# EAGLE design Programmateur-ICSP-Atmel (EAGLE 8.3.2)
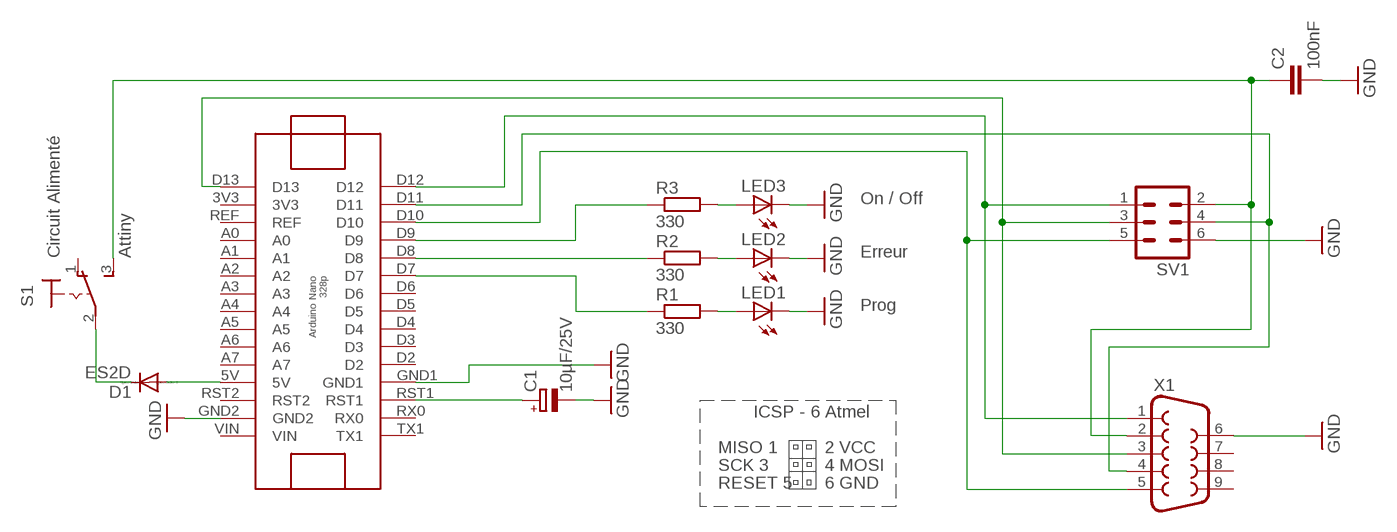
[diagram p0: schematic, sheet 1]

## Parts
ARDUINO-NANO1  ARDUINO-NANO  [ARDUINO-NANO]
C1  10µF/25V  CPOL-EUE2.5-5  [E2,5-5]
C2  100nF  C-EUC0805  [C0805]
D1  ES2D  [SMB]
LED1  LED5MM  [LED5MM]
LED2  LED5MM  [LED5MM]
LED3  LED5MM  [LED5MM]
R1  330  R-EU_R0805  [R0805]
R2  330  R-EU_R0805  [R0805]
R3  330  R-EU_R0805  [R0805]
S1  320-916  [320-916]
SV1  ML6L  [ML6L]
X1  F09HP  [F09HP]

## Nets
GND: ARDUINO-NANO1.GND1 ARDUINO-NANO1.GND2 C1.- C2.2 LED1.K(C) LED2.K(C) LED3.K(C) SV1.6 X1.6
MISO: ARDUINO-NANO1.D12 SV1.1 X1.1
MOSI: ARDUINO-NANO1.D11 SV1.4 X1.4
N$1: LED1.A R1.2
N$2: ARDUINO-NANO1.D7 R1.1
N$3: ARDUINO-NANO1.D8 R2.1
N$4: LED2.A R2.2
N$5: ARDUINO-NANO1.D9 R3.1
N$6: LED3.A R3.2
N$7: ARDUINO-NANO1.5V D1.A
N$9: ARDUINO-NANO1.RST1 C1.+
N$11: D1.C S1.2(P)
RESET: ARDUINO-NANO1.D10 SV1.5 X1.5
SCK: ARDUINO-NANO1.D13 SV1.3 X1.3
VCC: C2.1 S1.3(S) SV1.2 X1.2
Unconnected: ARDUINO-NANO1.3V3 ARDUINO-NANO1.A0 ARDUINO-NANO1.A1 ARDUINO-NANO1.A2 ARDUINO-NANO1.A3 ARDUINO-NANO1.A4 ARDUINO-NANO1.A5 ARDUINO-NANO1.A6 ARDUINO-NANO1.A7 ARDUINO-NANO1.D2 ARDUINO-NANO1.D3 ARDUINO-NANO1.D4 ARDUINO-NANO1.D5 ARDUINO-NANO1.D6 ARDUINO-NANO1.REF ARDUINO-NANO1.RST2 ARDUINO-NANO1.RX0 ARDUINO-NANO1.TX1 ARDUINO-NANO1.VIN S1.1(O) X1.7 X1.8 X1.9

## Notes on the sheet
- On / Off
- Circuit Alimenté | Attiny | Erreur
- Prog
- ICSP - 6 Atmel
- MISO 1 | 2 VCC
- SCK 3 | 4 MOSI
- RESET 5 | 6 GND

## Library data of the parts
ARDUINO-NANO1 = Arduino-nano:ARDUINO-NANO
C1 = rcl:CPOL-EU: POLARIZED CAPACITOR, European symbol
C2 = rcl:C-EU: CAPACITOR, European symbol
D1 = diode:ES2D: DIODE super fast rectifier, 2 A
LED1-LED3 = led:LED: LED OSRAM: - CHIPLED LG R971, LG N971, LY N971, LG Q971, LY Q971, LO R971, LY R971 LH N974, LH R974 LS Q976, LO Q976, LY Q976 LO Q996 - Hyper CHIPLED LW Q18S LB Q993, LB Q99A, LB R99A - SideLED LS A670, LO A670, LY A670, LG A670, LP A670 LB A673, LV A673, LT A673, LW A673 LH A674 LY A675 LS A676, LA A676, LO A676, LY A676, LW A676 LS A679, LY A679, LG A679 - Hyper Micro SIDELED® LS Y876, LA Y876, LO Y876, LY Y876 LT Y87S - SmartLED LW L88C, LW L88S LB L89C, LB L89S, LG L890 LS L89K, LO L89K, LY L89K LS L896, LA L896, LO L896, LY L896 - TOPLED LS T670, LO T670, LY T670, LG T670, LP T670 LSG T670, LSP T670, LSY T670, LOP T670, LYG T670 LG T671, LOG T671, LSG T671 LB T673, LV T673, LT T673, LW T673 LH T674 LS T676, LA T676, LO T676, LY T676, LB T676, LH T676, LSB T676, LW T676 LB T67C, LV T67C, LT T67C, LS T67K, LO T67K, LY T67K, LW E67C LS E67B, LA E67B, LO E67B, LY E67B, LB E67C, LV E67C, LT E67C LW T67C LS T679, LY T679, LG T679 LS T770, LO T770, LY T770, LG T770, LP T770 LB T773, LV T773, LT T773, LW T773 LH T774 LS E675, LA E675, LY E675, LS T675 LS T776, LA T776, LO T776, LY T776, LB T776 LHGB T686 LT T68C, LB T68C - Hyper Mini TOPLED® LB M676 - Mini TOPLED Santana® LG M470 LS M47K, LO M47K, LY M47K Source: http://www.osram.convergy.de LUXEON: - LUMILED® LXK2-PW12-R00, LXK2-PW12-S00, LXK2-PW14-U00, LXK2-PW14-V00 LXK2-PM12-R00, LXK2-PM12-S00, LXK2-PM14-U00 LXK2-PE12-Q00, LXK2-PE12-R00, LXK2-PE12-S00, LXK2-PE14-T00, LXK2-PE14-U00 LXK2-PB12-K00, LXK2-PB12-L00, LXK2-PB12-M00, LXK2-PB14-N00, LXK2-PB14-P00, LXK2-PB14-Q00 LXK2-PR12-L00, LXK2-PR12-M00, LXK2-PR14-Q00, LXK2-PR14-R00 LXK2-PD12-Q00, LXK2-PD12-R00, LXK2-PD12-S00 LXK2-PH12-R00, LXK2-PH12-S00 LXK2-PL12-P00, LXK2-PL12-Q00, LXK2-PL12-R00 Source: www.luxeon.com KINGBRIGHT: KA-3528ASYC Source: www.kingbright.com
R1-R3 = rcl:R-EU_: RESISTOR, European symbol
S1 = switch:320-916: TOGGLE SWITCH distributor RS Components
SV1 = con-harting-ml:ML6: HARTING; OC_FARNELL: unknown; OC_NEWARK: unknown
X1 = con-subd:F09: SUB-D; OC_FARNELL: unknown; OC_NEWARK: unknown

## Board
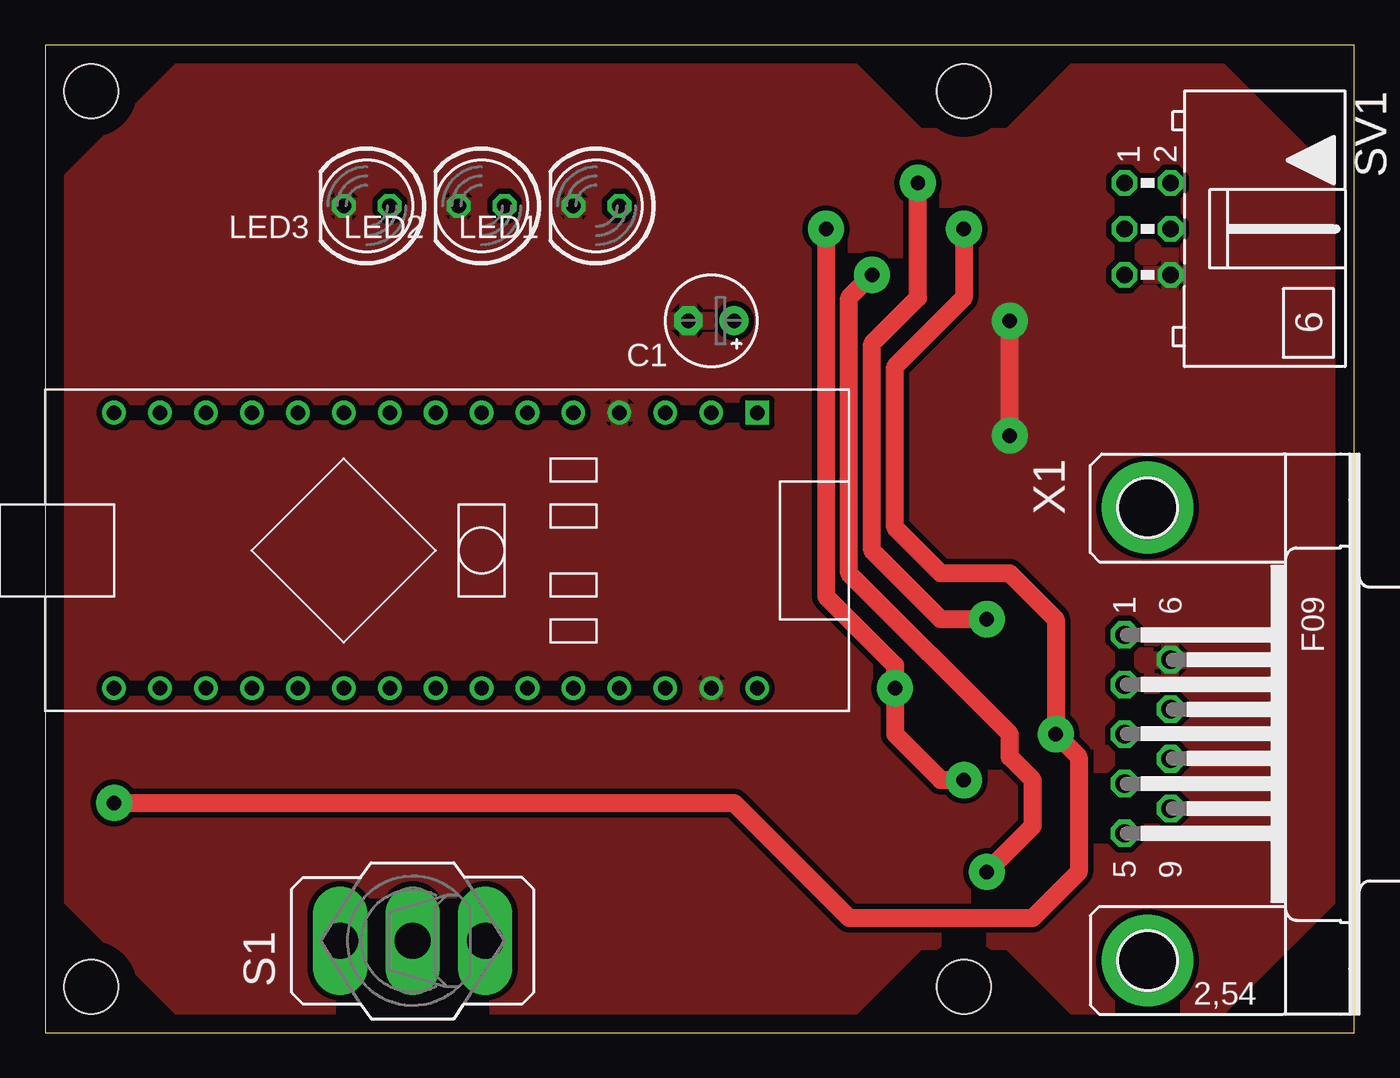
[diagram p1: board, top side]
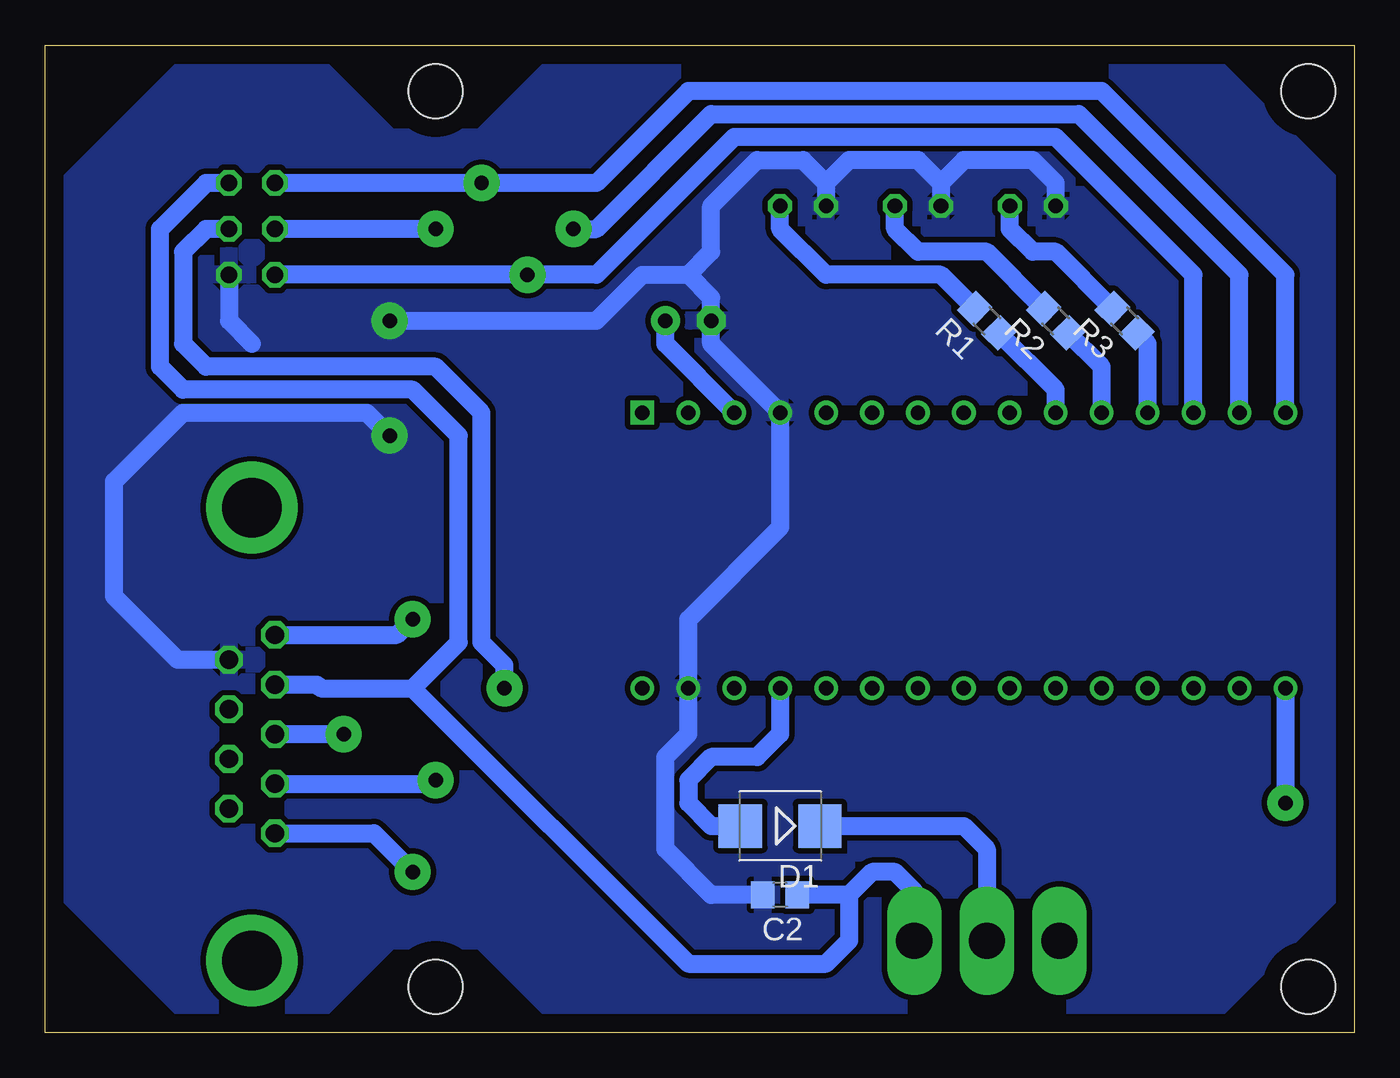
[diagram p2: board, bottom side, seen from below]

Size 72.39 x 54.61 mm. Coordinates in mm from the lower left corner, seen from the top.
Outline: 0,0 72.39,0 72.39,54.61 0,54.6 0,0
Copper layers (1*16): Top 0.035mm / dielectric 1.5mm / Bottom 0.035mm
Design rules "default": minimum track width 6mil, minimum drill 0.35mm, track to track 6mil, track to pad 6mil, pad to pad 6mil, via to via 6mil, smd to smd 6mil, copper to edge 40mil, drill to drill 6mil, minimum pad ring 10mil, minimum via ring 8mil, stop-mask expansion 4mil, vias tented up to drill 0mil, thermal gap 10mil
Holes 3 mm at 2.54,52.07 2.54,2.54 50.8,2.54 50.8,52.07

### Footprints (pad centres in the part's own frame; a part is rotated, then mirrored left to right if it is on the bottom)
ARDUINO-NANO = drill 0.8: 3V3 7.62,-16.51; 5V 7.62,8.89; A0 7.62,-11.43; A1 7.62,-8.89; A2 7.62,-6.35; A3 7.62,-3.81; A4 7.62,-1.27; A5 7.62,1.27; A6 7.62,3.81; A7 7.62,6.35; D2 -7.62,6.35; D3 -7.62,3.81; D4 -7.62,1.27; D5 -7.62,-1.27; D6 -7.62,-3.81; D7 -7.62,-6.35; D8 -7.62,-8.89; D9 -7.62,-11.43; D10 -7.62,-13.97; D11 -7.62,-16.51; D12 -7.62,-19.05; D13 7.62,-19.05; GND1 -7.62,8.89; GND2 7.62,13.97; REF 7.62,-13.97; RST1 -7.62,11.43; RST2 7.62,11.43; RX0 -7.62,13.97; VIN 7.62,16.51 | drill 0.8 square: TX1 -7.62,16.51
E2,5-5 = drill 0.813 pad 1.6: + -1.27,0 | drill 0.813 pad 1.6 octagon: - 1.27,0
C0805 = smd 1.3 x 1.5: 1 -0.95,0; 2 0.95,0
SMB = smd 2.4 x 2.4: A 2.2,0; C -2.2,0
LED5MM = drill 0.813 octagon: A -1.27,0; K 1.27,0
R0805 = smd 1.3 x 1.5: 1 -0.95,0; 2 0.95,0
320-916 = drill 2.007 long: 1 0,4.013; 2 0,0; 3 0,-4.013
ML6L = drill 0.914 octagon: 1 -2.54,-1.27; 2 -2.54,1.27; 3 0,-1.27; 4 0,1.27; 5 2.54,-1.27; 6 2.54,1.27
F09HP = drill 1.016 octagon: 1 -5.486,-1.27; 2 -2.743,-1.27; 3 0,-1.27; 4 2.743,-1.27; 5 5.486,-1.27; 6 -4.115,1.27; 7 -1.372,1.27; 8 1.372,1.27; 9 4.115,1.27 | drill 3.302 pad 5.08: G1 -12.522,0; G2 12.522,0

### Placement (x,y rotation side)
ARDUINO-NANO1  22.86,26.67 270 top
C1  36.83,39.37 180 top
C2  31.75,7.62 180 bottom
D1  31.75,11.43 180 bottom
LED1  30.48,45.72 180 top
LED2  24.13,45.72 180 top
LED3  17.78,45.72 180 top
R1  20.32,39.37 135 bottom
R2  16.51,39.37 135 bottom
R3  12.7,39.37 135 bottom
S1  20.32,5.08 90 top
SV1  60.96,44.45 270 top
X1  60.96,16.51 270 top

### Tracks (layer width: path | path; a pad name or v marks a point on that pad's centre or on a via)
GND  (via drill 0.8 pad 2)
  Top 1: v53.34,33.02 v53.34,39.37
  Bottom 1: LED3.K 16.51,46.99 17.78,48.26 21.59,48.26 22.86,46.99 | 22.86,46.99 LED2.K | 22.86,46.99 24.13,48.26 27.94,48.26 29.21,46.99 | 29.21,46.99 LED1.K | 29.21,46.99 30.48,48.26 33.02,48.26 35.56,45.72 35.56,43.18 36.83,41.91 | C2.2 35.56,7.62 38.1,10.16 38.1,15.24 36.83,16.51 ARDUINO-NANO1.GND2 36.83,22.86 31.75,27.94 ARDUINO-NANO1.GND1 35.56,38.1 C1.- 35.56,40.64 36.83,41.91 | X1.6 65.08,20.62 68.58,24.13 68.58,30.48 64.77,34.29 54.61,34.29 v53.34,33.02 | v53.34,39.37 41.91,39.37 39.37,41.91 36.83,41.91 | SV1.6 62.23,39.37 60.96,38.1
  pour Bottom (isolate 0.3): 8.89,54.61 0,45.72 0,8.89 8.89,0 43.18,0 48.26,5.08 53.34,5.08 58.42,0 63.5,0 72.39,8.89 72.39,45.72 63.5,54.61 58.42,54.61 53.34,49.53 48.26,49.53 43.18,54.61
  pour Top (isolate 0.3): 0,45.72 0,8.89 8.89,0 43.18,0 48.26,5.08 53.34,5.08 58.42,0 63.5,0 72.39,8.89 72.39,45.72 63.5,54.61 58.42,54.61 53.34,49.53 48.26,49.53 43.18,54.61 8.89,54.61
MISO  (via drill 0.8 pad 2)
  Top 1: v52.07,22.86 49.53,22.86 45.72,26.67 45.72,38.1 48.26,40.64 v48.26,46.99
  Bottom 1: ARDUINO-NANO1.D12 3.81,41.91 13.97,52.07 36.83,52.07 41.91,46.99 v48.26,46.99 SV1.1 | X1.1 52.93,22 v52.07,22.86
MOSI  (via drill 0.8 pad 2)
  Top 1: v43.18,44.45 43.18,24.13 46.99,20.32 v46.99,19.05 46.99,16.51 49.53,13.97 v50.8,13.97
  Bottom 1: ARDUINO-NANO1.D11 6.35,41.91 15.24,50.8 35.56,50.8 41.91,44.45 v43.18,44.45 | SV1.4 63.5,44.45 64.77,43.18 64.77,38.1 63.5,36.83 50.8,36.83 48.26,34.29 48.26,21.59 46.99,20.32 v46.99,19.05 | X1.4 51,13.77 v50.8,13.97
N$1
  Bottom 1: R1.2 | R1.2 22.86,41.91 29.21,41.91 31.75,44.45 LED1.A
N$2
  Bottom 1: ARDUINO-NANO1.D7 16.51,35.56 R1.1
N$3
  Bottom 1: ARDUINO-NANO1.D8 13.97,36.83 R2.1
N$4
  Bottom 1: R2.2 | R2.2 20.32,43.18 24.13,43.18 25.4,44.45 LED2.A
N$5
  Bottom 1: ARDUINO-NANO1.D9 11.43,38.1 R3.1
N$6
  Bottom 1: R3.2 | R3.2 16.51,43.18 17.78,43.18 19.05,44.45 LED3.A
N$7
  Bottom 1: ARDUINO-NANO1.5V 31.75,16.51 33.02,15.24 35.56,15.24 36.83,13.97 36.83,12.7 35.56,11.43 D1.A
N$9
  Bottom 1: ARDUINO-NANO1.RST1 38.1,38.1 C1.+
N$11
  Bottom 1: D1.C 21.59,11.43 20.32,10.16 S1.2
RESET  (via drill 0.8 pad 2)
  Top 1: v52.07,8.89 54.61,11.43 54.61,13.97 53.34,15.24 53.34,16.51 44.45,25.4 44.45,40.64 v45.72,41.91
  Bottom 1: ARDUINO-NANO1.D10 8.89,41.91 16.51,49.53 34.29,49.53 41.91,41.91 v45.72,41.91 SV1.5 | X1.5 54.2,11.02 v52.07,8.89
SCK  (via drill 0.8 pad 2)
  Top 1: v3.81,12.7 38.1,12.7 44.45,6.35 54.61,6.35 57.15,8.89 57.15,15.24 v55.88,16.51 55.88,22.86 53.34,25.4 49.53,25.4 46.99,27.94 46.99,36.83 50.8,40.64 v50.8,44.45
  Bottom 1: X1.3 v55.88,16.51 | ARDUINO-NANO1.D13 v3.81,12.7 | v50.8,44.45 SV1.3
VCC
  Bottom 1: SV1.2 63.5,46.99 66.04,44.45 66.04,36.83 64.77,35.56 52.07,35.56 49.53,33.02 49.53,21.59 52.07,19.05 | X1.2 57.35,19.25 57.15,19.05 52.07,19.05 | S1.3 24.33,7.82 25.4,8.89 26.67,8.89 27.94,7.62 | 27.94,7.62 C2.1 | 27.94,7.62 27.94,5.08 29.21,3.81 36.83,3.81 52.07,19.05